# Altium project BW2098POE.PrjPcb (part 6 of 8)
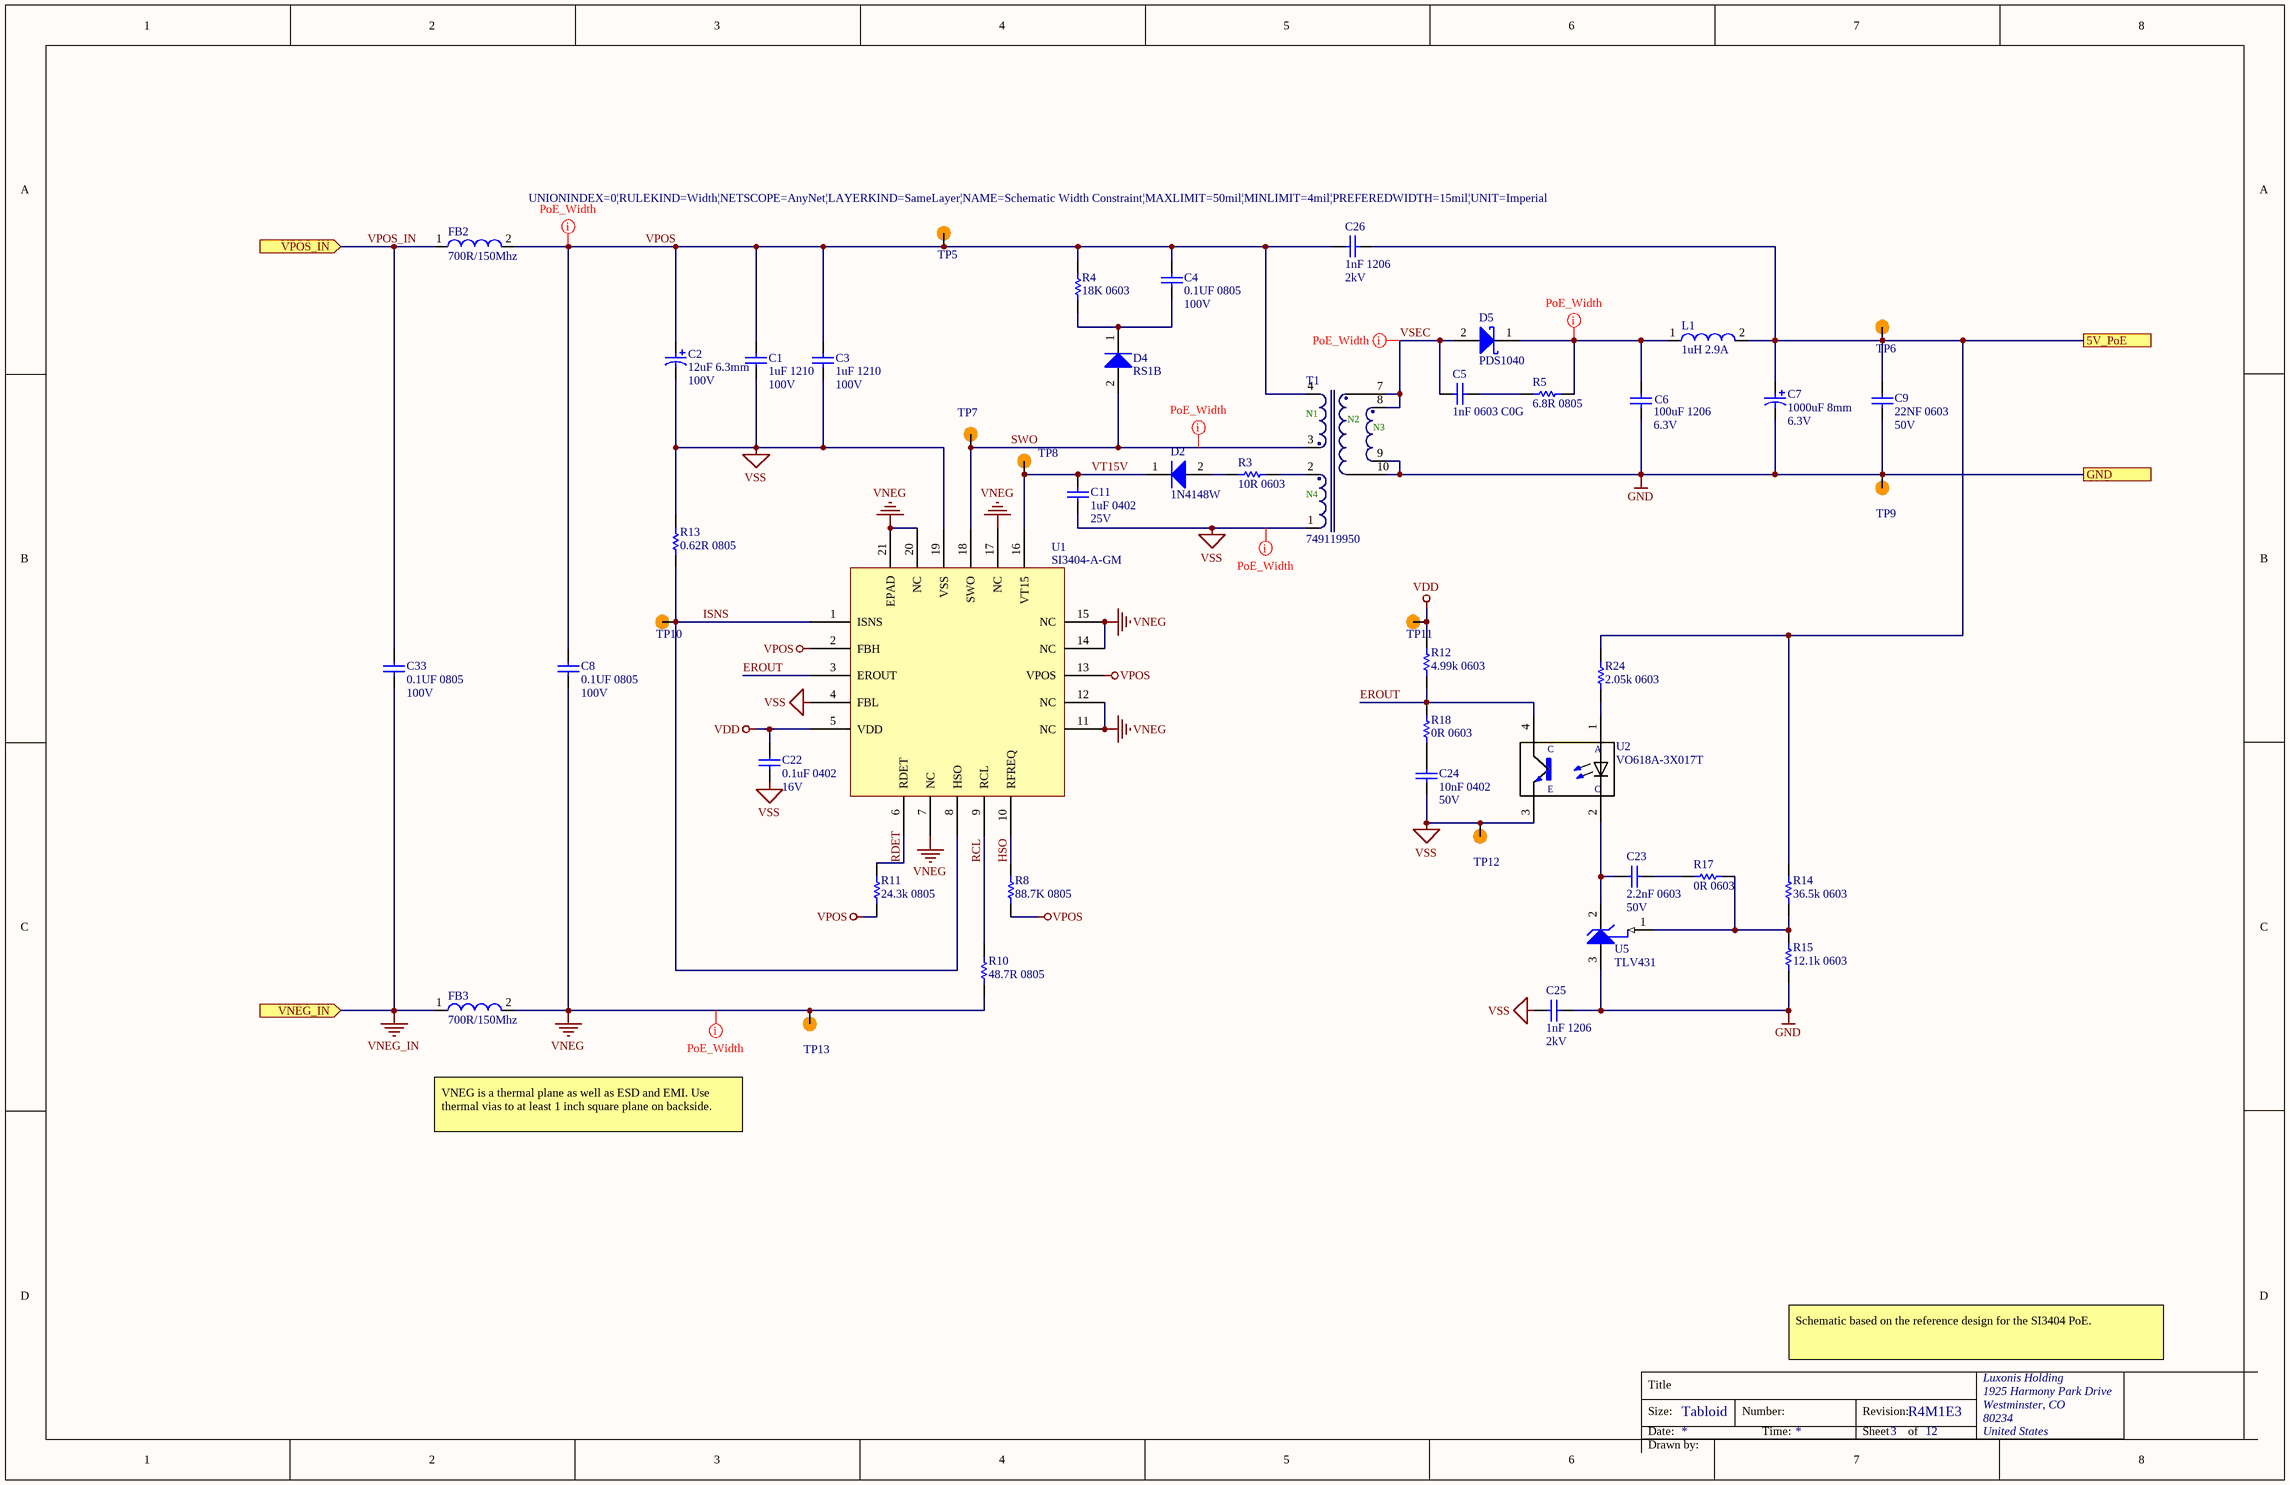
[diagram p13: PoE_Si3404.SchDoc]

## Sheet PoE_Si3404.SchDoc: =project_title (continued)
### Library data of the parts
C1 C3 = CL32B105KCJNNNE: CAP CER 1UF 100V X7R 1210; Manufacturer 1: Samsung; Tolerance: 10%; Supplier 1: Digi-Key; Manufacturer Part Number 1: CL32B105KCJNNNE; Stock 1: 69046; Pricing 1: 1=0.52000, 10=0.36100, 100=0.21650, 500=0.16236 (USD); RoHS: Yes; Mount: Surface Mount; Case/Package: 1210; Case Code (Metric): 3225; Case Code (Imperial): 1210; Min Operating Temperature: -55°C; Max Operating Temperature: 125°C; Packaging: Tape and Reel; Capacitance: 1uF; Dielectric: X7R; Voltage Rating (DC): 100V; Package Quantity: 1; Length: 3.2mm; Height: 2.5mm; Width: 0.098inch; Depth: 2.5mm; Thickness: 0.106inch; Radiation Hardening: No; Lead Free: Lead Free; ComponentLink1URL: https://datasheet.ciiva.com/26947/getdatasheetpartid-375850-26947031.pdf?src-supplier=Verical; ComponentLink1Description: https://datasheet.ciiva.com/26947/getdatasheetpartid-375850-26947031.pdf?src-supplier=Verical; ComponentLink2URL: https://datasheet.ciiva.com/16200/cl05b104kq5nnnc-16200037.pdf?src-supplier=Future+Electronics; ComponentLink2Description: https://datasheet.ciiva.com/16200/cl05b104kq5nnnc-16200037.pdf?src-supplier=Future+Electronics; Supplier 2: LCSC; Supplier 3: Future Electronics; Supplier Part Number 3: CL32B105KCJNNNE-CUTT; Supplier Part Number 2: C444847; Supplier Part Number 1: 1276-1812-1-ND
C2 = EEU-FC2A120: CAP ALUM 12UF 20% 100V RADIAL; Manufacturer 1: Panasonic; Lead/Base Style: Straight; Ripple Current: 114mA; Life (Hours): 1000Hour; ESR (Equivalent Series Resistance): 1.8R; Leakage Current: 3uA; Dissipation Factor: 0.07%; Polarity: Polar; Lead Diameter: 0.5mm; Supplier 1: Digi-Key; Manufacturer Part Number 1: EEU-FC2A120; Stock 1: 297; Pricing 1: 1=0.35000, 10=0.24500, 100=0.14670, 500=0.11002, 1000=0.09291, 2500=0.08802, 5000=0.08313 (USD); RoHS: Yes; Mount: Through Hole; Case/Package: Radial; Contact Plating: Tin; Min Operating Temperature: -55°C; Max Operating Temperature: 105°C; Capacitance: 12uF; Tolerance: 20%; Voltage Rating (DC): 100V; Packaging: Bulk; Package Quantity: 200; Voltage Rating: 100V; Impedance: 1.8R; Diameter: 6.3mm; Length: 11mm; Height: 11.2mm; Lead Pitch: 2.5mm; Height - Seated (Max): 0.48inch; Radiation Hardening: No; ComponentLink1URL: https://datasheet.ciiva.com/11781/0900766b80becf93-11781011.pdf?src-supplier=RSComponents; ComponentLink1Description: https://datasheet.ciiva.com/11781/0900766b80becf93-11781011.pdf?src-supplier=RSComponents; ComponentLink2URL: https://datasheet.ciiva.com/2984/aba0000ce22-2984054.pdf?src-supplier=Avnet; ComponentLink2Description: https://datasheet.ciiva.com/2984/aba0000ce22-2984054.pdf?src-supplier=Avnet; ComponentLink3URL: https://datasheet.ciiva.com/17535/aba0000ce22-17535638.pdf?src-supplier=Avnet+Europe; ComponentLink3Description: https://datasheet.ciiva.com/17535/aba0000ce22-17535638.pdf?src-supplier=Avnet+Europe; ComponentLink4URL: https://datasheet.ciiva.com/48518/eeufc-eng-tds-48518663.pdf?src-supplier=Distrelec; ComponentLink4Description: https://datasheet.ciiva.com/48518/eeufc-eng-tds-48518663.pdf?src-supplier=Distrelec; ComponentLink5URL: https://datasheet.ciiva.com/24023/a-e-461514-24023994.pdf?src-supplier=Mouser; ComponentLink5Description: https://datasheet.ciiva.com/24023/a-e-461514-24023994.pdf?src-supplier=Mouser; Supplier 2: Newark; Supplier Part Number 3: 667-EEU-FC2A120; Supplier Part Number 2: 47AC4895; Supplier 3: Mouser; Supplier Part Number 1: P19496-ND; Termination: Radial
C4 C8 C33 = CL21B104KCFNNNE: CAP CER 0.1UF 100V X7R 0805; Manufacturer 1: Samsung; Tolerance: 10%; Capacitance: 100nF; Supplier 1: Digi-Key; Manufacturer Part Number 1: CL21B104KCFNNNE; Stock 1: 93036; Pricing 1: 1=0.10000, 10=0.06800, 100=0.03050, 500=0.02180, 1000=0.01712 (USD); RoHS: Yes; Mount: Surface Mount; Case/Package: 0805; Case Code (Metric): 2012; Case Code (Imperial): 0805; Min Operating Temperature: -55°C; Max Operating Temperature: 125°C; Packaging: Tape and Reel; Dielectric: X7R; Length: 2mm; Width: 0.049inch; Thickness: 0.053inch; Depth: 1.25mm; Radiation Hardening: No; ComponentLink1URL: https://datasheet.ciiva.com/26936/getdatasheetpartid-781823-26936904.pdf?src-supplier=Verical; ComponentLink1Description: https://datasheet.ciiva.com/26936/getdatasheetpartid-781823-26936904.pdf?src-supplier=Verical; Supplier 2: Newark; Supplier 3: Future Electronics; Supplier Part Number 3: CL21B104KCFNNNE-CUTT; Supplier Part Number 2: 82AC9430; Supplier Part Number 1: 1276-6840-1-ND
C5 = GRM1885C1H102FA01D: CAP CER 1000PF 50V C0G/NP0 0603; Manufacturer: Murata; Material: Ceramic; Tolerance: 1%; Temperature Coefficient: 30ppm/°C; Manufacturer Part Number: GRM1885C1H102FA01D; RoHS: Yes; Mount: Surface Mount; Number of Pins: 2; Case Code (Metric): 1608; Case Code (Imperial): 0603; Min Operating Temperature: -55°C; Max Operating Temperature: 125°C; Packaging: Tape and Reel; Package Quantity: 4000; Termination: SMD/SMT; Voltage Rating (DC): 50V; Voltage: 50V; Length: 1.6mm; Height: 0.8mm; Width: 0.031inch; Thickness: 0.035inch; Depth: 0.8mm; Radiation Hardening: No; REACH SVHC: No SVHC; Lead Free: Lead Free; ComponentLink1URL: https://datasheet.ciiva.com/6072/1747444-6072454.pdf?src-supplier=Farnell; ComponentLink1Description: https://datasheet.ciiva.com/6072/1747444-6072454.pdf?src-supplier=Farnell; ComponentLink2URL: https://datasheet.ciiva.com/7828/1747444-7828892.pdf?src-supplier=Element14; ComponentLink2Description: https://datasheet.ciiva.com/7828/1747444-7828892.pdf?src-supplier=Element14; ComponentLink3URL: https://datasheet.ciiva.com/11621/c02e-11621692.pdf?src-supplier=Avnet; ComponentLink3Description: https://datasheet.ciiva.com/11621/c02e-11621692.pdf?src-supplier=Avnet; ComponentLink4URL: https://datasheet.ciiva.com/16624/c02e-16624140.pdf?src-supplier=Avnet+Europe; ComponentLink4Description: https://datasheet.ciiva.com/16624/c02e-16624140.pdf?src-supplier=Avnet+Europe; ComponentLink5URL: https://datasheet.ciiva.com/22698/1747444-22698428.pdf?src-supplier=Element14; ComponentLink5Description: https://datasheet.ciiva.com/22698/1747444-22698428.pdf?src-supplier=Element14; ComponentLink6URL: https://datasheet.ciiva.com/5416/c02e-5416637.pdf?src-supplier=Mouser; ComponentLink6Description: https://datasheet.ciiva.com/5416/c02e-5416637.pdf?src-supplier=Mouser; ComponentLink7URL: https://datasheet.ciiva.com/6270/partnumbering-e-01-6270573.pdf?src-supplier=Digi-Key; ComponentLink7Description: https://datasheet.ciiva.com/6270/partnumbering-e-01-6270573.pdf?src-supplier=Digi-Key; ComponentLink8URL: https://datasheet.ciiva.com/6270/partnumbering-e-01-6270574.pdf?src-supplier=Digi-Key; ComponentLink8Description: https://datasheet.ciiva.com/6270/partnumbering-e-01-6270574.pdf?src-supplier=Digi-Key; ComponentLink9URL: https://datasheet.ciiva.com/6270/partnumbering-e-01-6270575.pdf?src-supplier=Digi-Key; ComponentLink9Description: https://datasheet.ciiva.com/6270/partnumbering-e-01-6270575.pdf?src-supplier=Digi-Key; ComponentLink10URL: https://datasheet.ciiva.com/16426/l0005e-16426367.pdf?src-supplier=Future+Electronics; ComponentLink10Description: https://datasheet.ciiva.com/16426/l0005e-16426367.pdf?src-supplier=Future+Electronics; Supplier 1: Digi-Key; Manufacturer 1: Murata; Manufacturer Part Number 1: GRM1885C1H102FA01D; Stock 1: 343900; Pricing 1: 1=0.19000, 10=0.13300, 100=0.06260, 500=0.04386, 1000=0.03631 (USD); Case/Package: 0603; Capacitance: 1nF; Dielectric: C0G; Voltage Rating: 50V; Supplier Part Number 1: 490-6376-1-ND
C6 = CL31A107MQHNNNE: CAP CER 100UF 6.3V X5R 1206; Manufacturer 1: Samsung; Material: Ceramic; Tolerance: 20%; Supplier 1: Digi-Key; Manufacturer Part Number 1: CL31A107MQHNNNE; Stock 1: 75241; Pricing 1: 1=0.63000, 10=0.44200, 100=0.29120, 500=0.21574, 1000=0.18337 (USD); RoHS: Yes; Mount: Surface Mount; Case/Package: 1206; Case Code (Metric): 3216; Case Code (Imperial): 1206; Contact Plating: Tin; Min Operating Temperature: -55°C; Max Operating Temperature: 85°C; Capacitance: 100uF; Dielectric: X5R; Packaging: Tape and Reel; Package Quantity: 2000; Voltage Rating: 6.3V; Length: 3.2mm; Height: 1.6mm; Width: 0.063inch; Thickness: 0.071inch; Depth: 1.6mm; Radiation Hardening: No; ComponentLink1URL: https://datasheet.ciiva.com/25723/cl31a107mqhnnne-25723159.pdf?src-supplier=Digi-Key; ComponentLink1Description: https://datasheet.ciiva.com/25723/cl31a107mqhnnne-25723159.pdf?src-supplier=Digi-Key; ComponentLink2URL: https://datasheet.ciiva.com/16437/cl31a107mqhnnne-16437212.pdf?src-supplier=Future+Electronics; ComponentLink2Description: https://datasheet.ciiva.com/16437/cl31a107mqhnnne-16437212.pdf?src-supplier=Future+Electronics; ComponentLink3URL: https://datasheet.ciiva.com/15195/getdatasheetpartid-358449-15195997.pdf?src-supplier=Verical; ComponentLink3Description: https://datasheet.ciiva.com/15195/getdatasheetpartid-358449-15195997.pdf?src-supplier=Verical; ComponentLink4URL: https://datasheet.ciiva.com/29201/452463-da-01-en-vs-kondensator-1206-29201265.pdf?src-supplier=Conrad; ComponentLink4Description: https://datasheet.ciiva.com/29201/452463-da-01-en-vs-kondensator-1206-29201265.pdf?src-supplier=Conrad; ComponentLink5URL: https://datasheet.ciiva.com/20173/71-0886-20173093.pdf?src-supplier=Rapid+Electronics; ComponentLink5Description: https://datasheet.ciiva.com/20173/71-0886-20173093.pdf?src-supplier=Rapid+Electronics; Supplier 2: Newark; Supplier 3: Future Electronics; Supplier Part Number 1: 1276-1782-1-ND; Supplier Part Number 2: 82AC9489; Supplier Part Number 3: CL31A107MQHNNNE-CUTT
C7 = ECA-0JM102: CAP ALUM 1000UF 20% 6.3V RADIAL; Manufacturer 1: Panasonic; Capacitance: 1mF; Ripple Current: 580mA; Life (Hours): 2000Hour; Dissipation Factor: 0.28%; Lead/Base Style: Straight; Polarity: Polar; Leakage Current: 3uA; Lead Diameter: 0.6mm; Supplier 1: Digi-Key; Manufacturer Part Number 1: ECA-0JM102; Stock 1: 56407; Pricing 1: 1=0.31000, 10=0.21500, 100=0.12900, 500=0.09676, 1000=0.08170, 2500=0.07740, 5000=0.07310 (USD); RoHS: Yes; Mount: Through Hole,PCB; Case/Package: Radial; Number of Pins: 2; Contact Plating: Tin; Min Operating Temperature: -40°C; Max Operating Temperature: 85°C; Tolerance: 20%; Termination: Radial; Voltage Rating (DC): 6.3V; Packaging: Bulk; Voltage Rating: 6.3V; Package Quantity: 200; Diameter: 8mm; Length: 11.5mm; Height: 11.5mm; Lead Pitch: 3.5mm; Height - Seated (Max): 0.492inch; Radiation Hardening: No; REACH SVHC: No SVHC; ComponentLink1URL: https://datasheet.ciiva.com/11778/0900766b80f2e8a9-11778836.pdf?src-supplier=RSComponents; ComponentLink1Description: https://datasheet.ciiva.com/11778/0900766b80f2e8a9-11778836.pdf?src-supplier=RSComponents; ComponentLink2URL: https://datasheet.ciiva.com/16200/aba0000ce12-16200775.pdf?src-supplier=Future+Electronics; ComponentLink2Description: https://datasheet.ciiva.com/16200/aba0000ce12-16200775.pdf?src-supplier=Future+Electronics; ComponentLink3URL: https://datasheet.ciiva.com/17534/aba0000ce12-17534135.pdf?src-supplier=Avnet+Europe; ComponentLink3Description: https://datasheet.ciiva.com/17534/aba0000ce12-17534135.pdf?src-supplier=Avnet+Europe; ComponentLink4URL: https://datasheet.ciiva.com/24069/aba0000ce12-465472-24069879.pdf?src-supplier=Mouser; ComponentLink4Description: https://datasheet.ciiva.com/24069/aba0000ce12-465472-24069879.pdf?src-supplier=Mouser; ComponentLink5URL: https://datasheet.ciiva.com/46386/654936-46386263.pdf?src-supplier=Element14; ComponentLink5Description: https://datasheet.ciiva.com/46386/654936-46386263.pdf?src-supplier=Element14; ComponentLink6URL: https://datasheet.ciiva.com/2983/aba0000ce12-2983818.pdf?src-supplier=Avnet; ComponentLink6Description: https://datasheet.ciiva.com/2983/aba0000ce12-2983818.pdf?src-supplier=Avnet; ComponentLink7URL: https://datasheet.ciiva.com/16465/aba0000ce12-16465274.pdf?src-supplier=Avnet+Asia; ComponentLink7Description: https://datasheet.ciiva.com/16465/aba0000ce12-16465274.pdf?src-supplier=Avnet+Asia; ComponentLink8URL: https://datasheet.ciiva.com/15197/getdatasheetpartid-255691-15197835.pdf?src-supplier=Verical; ComponentLink8Description: https://datasheet.ciiva.com/15197/getdatasheetpartid-255691-15197835.pdf?src-supplier=Verical; ComponentLink9URL: https://datasheet.ciiva.com/92/aba0000ce12-92526.pdf?src-supplier=Digi-Key; ComponentLink9Description: https://datasheet.ciiva.com/92/aba0000ce12-92526.pdf?src-supplier=Digi-Key; ComponentLink10URL: https://datasheet.ciiva.com/30129/49aba0000ce12-30129310.pdf?src-supplier=Onlinecomponents.com; ComponentLink10Description: https://datasheet.ciiva.com/30129/49aba0000ce12-30129310.pdf?src-supplier=Onlinecomponents.com; Supplier 2: Newark; Supplier 3: Mouser; Supplier Part Number 3: 667-ECA-0JM102; Supplier Part Number 2: 17T4979; Supplier Part Number 1: P5115-ND
C9 = C0603C223K5RACTU: CAP CER 0.022UF 50V X7R 0603; Manufacturer 1: KEMET; Dielectric Material: Ceramic; Tolerance: 10%; Dissipation Factor: 2.5%; Supplier 1: Digi-Key; Manufacturer Part Number 1: C0603C223K5RACTU; Stock 1: 77845; Pricing 1: 1=0.10000, 10=0.06400, 100=0.02850, 500=0.02036, 1000=0.01600 (USD); RoHS: Yes; Mount: Surface Mount,PCB; Case/Package: 0603; Number of Pins: 2; Case Code (Imperial): 0603; Case Code (Metric): 1608; Contact Plating: Tin,Matte; Min Operating Temperature: -55°C; Max Operating Temperature: 125°C; Capacitance: 22nF; Packaging: Tape and Reel; Voltage Rating (DC): 50V; Dielectric: X7R; Package Quantity: 4000; Termination: SMD/SMT; Voltage Rating: 50V; Length: 1.6mm; Height: 0.8mm; Depth: 0.8mm; Width: 0.8mm; Thickness: 0.034inch; Lead Pitch: 0.7mm; Radiation Hardening: No; REACH SVHC: No SVHC; ComponentLink1URL: https://datasheet.ciiva.com/7823/1776091-7823698.pdf?src-supplier=Element14; ComponentLink1Description: https://datasheet.ciiva.com/7823/1776091-7823698.pdf?src-supplier=Element14; ComponentLink2URL: https://datasheet.ciiva.com/7824/kem-c1002-x7r-smd-7824021.pdf?src-supplier=Element14; ComponentLink2Description: https://datasheet.ciiva.com/7824/kem-c1002-x7r-smd-7824021.pdf?src-supplier=Element14; Supplier 2: Mouser; Supplier Part Number 1: 399-1280-6-ND; Supplier Part Number 2: 80-C0603C223K5R
C11 = GRM155R61E105KA12D: CAP CER 1UF 25V X5R 0402 10%; Manufacturer 1: Murata; Material: Ceramic; Supplier 1: Digi-Key; Manufacturer Part Number 1: GRM155R61E105KA12D; Stock 1: 200653; Pricing 1: 1=0.10000, 10=0.07100, 100=0.03350, 500=0.02352, 1000=0.01947, 2500=0.01812, 5000=0.01658 (USD); RoHS: Yes; Mount: Surface Mount; Case/Package: 0402; Weight: 0.000212oz; Case Code (Metric): 1005; Case Code (Imperial): 0402; Min Operating Temperature: -55°C; Max Operating Temperature: 85°C; Tolerance: 10%; Capacitance: 1uF; Dielectric: X5R; Voltage Rating (DC): 25V; Packaging: Tape and Reel; Package Quantity: 10000; Termination: SMD/SMT; Voltage: 25V; Length: 1mm; Height: 0.5mm; Width: 0.5mm; Thickness: 0.022inch; Depth: 0.5mm; Lead Free: Lead Free; REACH SVHC: No SVHC; ComponentLink1URL: https://datasheet.ciiva.com/22732/1666664-22732122.pdf?src-supplier=Element14; ComponentLink1Description: https://datasheet.ciiva.com/22732/1666664-22732122.pdf?src-supplier=Element14; ComponentLink2URL: https://datasheet.ciiva.com/7719/1666664-7719006.pdf?src-supplier=Element14; ComponentLink2Description: https://datasheet.ciiva.com/7719/1666664-7719006.pdf?src-supplier=Element14; Supplier Part Number 1: 490-10017-1-ND; Supplier 2: Arrow; Supplier 3: TTI; Supplier Part Number 2: GRM155R61E105KA12D; Supplier Part Number 3: GRM155R61E105KA12D
C22 = CL05B104KO5NFNC: CAP CER 0.1UF 16V X7R 0402; Manufacturer 1: Samsung; Tolerance: 10%; Capacitance: 100nF; Supplier 1: Digi-Key; Manufacturer Part Number 1: CL05B104KO5NFNC; Stock 1: 877172; Pricing 1: 1=0.10000, 10=0.02400, 100=0.01060, 500=0.00760, 1000=0.00597, 2500=0.00542, 5000=0.00499 (USD); RoHS: Yes; Mount: Surface Mount; Case/Package: 0402; Case Code (Metric): 1005; Case Code (Imperial): 0402; Min Operating Temperature: -55°C; Max Operating Temperature: 125°C; Packaging: Tape and Reel; Package Quantity: 1; Dielectric: X7R; Length: 1mm; Height: 0.5mm; Width: 0.02inch; Thickness: 0.022inch; Depth: 0.5mm; Radiation Hardening: No; ComponentLink1URL: https://datasheet.ciiva.com/25767/cl05b104ko5nfnc-25767124.pdf?src-supplier=Digi-Key; ComponentLink1Description: https://datasheet.ciiva.com/25767/cl05b104ko5nfnc-25767124.pdf?src-supplier=Digi-Key; Supplier 2: Newark; Supplier 3: Element14; Supplier Part Number 1: 1276-1508-1-ND; Supplier Part Number 3: 3013348; Supplier Part Number 2: 82AC9215
C23 = GRM1885C1H222JA01D: CAP CER 2200PF 50V C0G/NP0 0603; Manufacturer 1: Murata; Dielectric Material: Ceramic; Tolerance: 5%; Dielectric: C0G; Temperature Coefficient: 30ppm/°C; Insulation Resistance: 10GR; Supplier 1: Digi-Key; Manufacturer Part Number 1: GRM1885C1H222JA01D; Stock 1: 1457512; Pricing 1: 1=0.14000, 10=0.09800, 100=0.04610, 500=0.03234, 1000=0.02678 (USD); RoHS: Yes; Mount: Surface Mount; Case/Package: 0603; Number of Pins: 2; Case Code (Imperial): 0603; Case Code (Metric): 1608; Material: Ceramic; Min Operating Temperature: -55°C; Max Operating Temperature: 125°C; Capacitance: 2.2nF; Packaging: Tape and Reel; Voltage Rating (DC): 50V; Voltage Rating: 50V; Termination: SMD/SMT; Package Quantity: 1; Length: 1.6mm; Height: 0.8mm; Width: 0.8mm; Depth: 0.8mm; Thickness: 0.035inch; Radiation Hardening: No; Lead Free: Lead Free; REACH SVHC: No SVHC; ComponentLink1URL: https://datasheet.ciiva.com/11786/0900766b807a1cab-11786840.pdf?src-supplier=RSComponents; ComponentLink1Description: https://datasheet.ciiva.com/11786/0900766b807a1cab-11786840.pdf?src-supplier=RSComponents; ComponentLink2URL: https://datasheet.ciiva.com/3777/1632grm1885c1h222ja0123-3777835.pdf?src-supplier=Arrow; ComponentLink2Description: https://datasheet.ciiva.com/3777/1632grm1885c1h222ja0123-3777835.pdf?src-supplier=Arrow; ComponentLink3URL: https://datasheet.ciiva.com/2989/product-2989459.pdf?src-supplier=Avnet; ComponentLink3Description: https://datasheet.ciiva.com/2989/product-2989459.pdf?src-supplier=Avnet; ComponentLink4URL: https://datasheet.ciiva.com/6031/4360-6031797.pdf?src-supplier=Farnell; ComponentLink4Description: https://datasheet.ciiva.com/6031/4360-6031797.pdf?src-supplier=Farnell; ComponentLink5URL: https://datasheet.ciiva.com/7828/4360-7828918.pdf?src-supplier=Element14; ComponentLink5Description: https://datasheet.ciiva.com/7828/4360-7828918.pdf?src-supplier=Element14; ComponentLink6URL: https://datasheet.ciiva.com/11463/product-11463974.pdf?src-supplier=Avnet; ComponentLink6Description: https://datasheet.ciiva.com/11463/product-11463974.pdf?src-supplier=Avnet; ComponentLink7URL: https://datasheet.ciiva.com/16624/product-16624150.pdf?src-supplier=Avnet+Europe; ComponentLink7Description: https://datasheet.ciiva.com/16624/product-16624150.pdf?src-supplier=Avnet+Europe; ComponentLink8URL: https://datasheet.ciiva.com/7828/1747455-7828919.pdf?src-supplier=Element14; ComponentLink8Description: https://datasheet.ciiva.com/7828/1747455-7828919.pdf?src-supplier=Element14; ComponentLink9URL: https://datasheet.ciiva.com/133/partnumbering-e-01-133576.pdf?src-supplier=Digi-Key; ComponentLink9Description: https://datasheet.ciiva.com/133/partnumbering-e-01-133576.pdf?src-supplier=Digi-Key; ComponentLink10URL: https://datasheet.ciiva.com/7828/1747455-7828920.pdf?src-supplier=Element14; ComponentLink10Description: https://datasheet.ciiva.com/7828/1747455-7828920.pdf?src-supplier=Element14; ComponentLink11URL: https://datasheet.ciiva.com/133/partnumbering-e-01-133577.pdf?src-supplier=Digi-Key; ComponentLink11Description: https://datasheet.ciiva.com/133/partnumbering-e-01-133577.pdf?src-supplier=Digi-Key; ComponentLink12URL: https://datasheet.ciiva.com/133/partnumbering-e-01-133578.pdf?src-supplier=Digi-Key; ComponentLink12Description: https://datasheet.ciiva.com/133/partnumbering-e-01-133578.pdf?src-supplier=Digi-Key; ComponentLink13URL: https://datasheet.ciiva.com/29241/450664-da-01-en-vs-kondensator-0603-29241770.pdf?src-supplier=Conrad; ComponentLink13Description: https://datasheet.ciiva.com/29241/450664-da-01-en-vs-kondensator-0603-29241770.pdf?src-supplier=Conrad; Supplier 2: Future Electronics; Supplier 3: Mouser; Supplier Part Number 1: 490-1459-1-ND; Supplier Part Number 2: GRM1885C1H222JA01D-CUTT; Supplier Part Number 3: 81-GRM1885C1H222JA01
C24 = GRM155R71H103KA88D: CAP CER 10000PF 50V X7R 0402; Manufacturer 1: Murata; Material: Ceramic; Tolerance: 10%; Voltage: 25V; Supplier 1: Digi-Key; Manufacturer Part Number 1: GRM155R71H103KA88D; Stock 1: 6923572; Pricing 1: 1=0.10000, 10=0.03800, 100=0.01690, 500=0.01208, 1000=0.00949, 2500=0.00862, 5000=0.00794 (USD); RoHS: Yes; Mount: Surface Mount; Case/Package: 0402; Number of Pins: 2; Case Code (Metric): 1005; Case Code (Imperial): 0402; Min Operating Temperature: -55°C; Max Operating Temperature: 125°C; Capacitance: 10nF; Packaging: Tape and Reel; Termination: SMD/SMT; Voltage Rating (DC): 50V; Package Quantity: 1; Dielectric: X7R; Length: 1mm; Height: 0.5mm; Width: 0.02inch; Thickness: 0.022inch; Depth: 0.5mm; Radiation Hardening: No; REACH SVHC: No SVHC; Lead Free: Lead Free; ComponentLink1URL: https://datasheet.ciiva.com/129/product-129810.pdf?src-supplier=Digi-Key; ComponentLink1Description: https://datasheet.ciiva.com/129/product-129810.pdf?src-supplier=Digi-Key; ComponentLink2URL: https://datasheet.ciiva.com/19476/1856433-19476546.pdf?src-supplier=Jameco; ComponentLink2Description: https://datasheet.ciiva.com/19476/1856433-19476546.pdf?src-supplier=Jameco; ComponentLink3URL: https://datasheet.ciiva.com/11786/0900766b80ef921d-11786340.pdf?src-supplier=RSComponents; ComponentLink3Description: https://datasheet.ciiva.com/11786/0900766b80ef921d-11786340.pdf?src-supplier=RSComponents; ComponentLink4URL: https://datasheet.ciiva.com/18100/getdatasheetpartid-27434-18100660.pdf?src-supplier=Verical; ComponentLink4Description: https://datasheet.ciiva.com/18100/getdatasheetpartid-27434-18100660.pdf?src-supplier=Verical; ComponentLink5URL: https://datasheet.ciiva.com/22698/1747449-22698420.pdf?src-supplier=Element14; ComponentLink5Description: https://datasheet.ciiva.com/22698/1747449-22698420.pdf?src-supplier=Element14; ComponentLink6URL: https://datasheet.ciiva.com/29199/454225-da-01-en-vs-kondensator-0402-29199740.pdf?src-supplier=Conrad; ComponentLink6Description: https://datasheet.ciiva.com/29199/454225-da-01-en-vs-kondensator-0402-29199740.pdf?src-supplier=Conrad; ComponentLink7URL: https://datasheet.ciiva.com/129/grm155r71h103ka88-01-129811.pdf?src-supplier=Digi-Key; ComponentLink7Description: https://datasheet.ciiva.com/129/grm155r71h103ka88-01-129811.pdf?src-supplier=Digi-Key; ComponentLink8URL: https://datasheet.ciiva.com/129/grm155r71h103ka88-01-129812.pdf?src-supplier=Digi-Key; ComponentLink8Description: https://datasheet.ciiva.com/129/grm155r71h103ka88-01-129812.pdf?src-supplier=Digi-Key; ComponentLink9URL: https://datasheet.ciiva.com/16495/product-16495290.pdf?src-supplier=Future+Electronics; ComponentLink9Description: https://datasheet.ciiva.com/16495/product-16495290.pdf?src-supplier=Future+Electronics; ComponentLink10URL: https://datasheet.ciiva.com/5410/product-5410990.pdf?src-supplier=Mouser; ComponentLink10Description: https://datasheet.ciiva.com/5410/product-5410990.pdf?src-supplier=Mouser; Supplier 2: Mouser; Supplier 3: Arrow; Supplier Part Number 1: 490-4516-1-ND; Supplier Part Number 2: 81-GRM155R71H103KA8D; Supplier Part Number 3: GRM155R71H103KA88D
C25 C26 = C1206C102KGRACTU: CAP CER 1000PF 2KV X7R 1206; Manufacturer 1: KEMET; Dielectric Material: Ceramic; Tolerance: 10%; Supplier 1: Digi-Key; Manufacturer Part Number 1: C1206C102KGRACTU; Stock 1: 54320; Pricing 1: 1=0.26000, 10=0.17500, 100=0.09940, 500=0.07014, 1000=0.06138 (USD); RoHS: Yes; Mount: Surface Mount; Case/Package: 1206; Min Operating Temperature: -55°C; Max Operating Temperature: 125°C; Capacitance: 1nF; Packaging: Tape and Reel; Dielectric: X7R; Length: 3.2mm; Height: 1.6mm; Depth: 1.6mm; Radiation Hardening: No; ComponentLink1URL: https://datasheet.ciiva.com/18194/getdatasheetpartid-359031-18194095.pdf?src-supplier=Verical; ComponentLink1Description: https://datasheet.ciiva.com/18194/getdatasheetpartid-359031-18194095.pdf?src-supplier=Verical; ComponentLink2URL: https://datasheet.ciiva.com/28610/1372242-28610895.pdf?src-supplier=Element14; ComponentLink2Description: https://datasheet.ciiva.com/28610/1372242-28610895.pdf?src-supplier=Element14; ComponentLink3URL: https://datasheet.ciiva.com/28672/1807957-28672854.pdf?src-supplier=Element14; ComponentLink3Description: https://datasheet.ciiva.com/28672/1807957-28672854.pdf?src-supplier=Element14; Supplier 2: Newark; Supplier 3: Newark; Supplier Part Number 1: 399-4819-1-ND; Supplier Part Number 2: 01N5611; Supplier Part Number 3: 68K2517
D2 = 1N4148W-7-F: DIODE GEN PURP 100V 300MA SOD123; Manufacturer 1: Diodes; Element Configuration: Single; Forward Current: 150mA; Forward Voltage: 1.25V; Reverse Recovery Time: 4ns; Peak Non-Repetitive Surge Current: 2A; Peak Reverse Current: 1uA; Power Dissipation: 400mW; Polarity: Standard; Voltage Rating (DC): 75V; Capacitance: 2pF; Current: 15A; Supplier 1: Digi-Key; Manufacturer Part Number 1: 1N4148W-7-F; Stock 1: 5430248; Pricing 1: 1=0.16000, 10=0.15000, 100=0.06290, 500=0.04942, 1000=0.03432 (USD); RoHS: Yes; Mount: Surface Mount; Number of Pins: 2; Weight: 0.000353oz; Contact Plating: Tin,Matte; Min Operating Temperature: -65°C; Max Operating Temperature: 150°C; Packaging: Tape and Reel; Package Quantity: 3000; Max Repetitive Reverse Voltage (Vrrm): 100V; Recovery Time: 4ns; Average Rectified Current: 300mA; Max Reverse Voltage (DC): 100V; Max Surge Current: 2A; Max Forward Surge Current (Ifsm): 2A; Power Rating: 400mW; Current Rating: 150mA; Output Current: 150mA; Voltage: 100V; Length: 2.85mm; Height: 1.25mm; Width: 1.7mm; Radiation Hardening: No; Lead Free: Lead Free; REACH SVHC: No SVHC; ComponentLink1URL: https://datasheet.ciiva.com/4435/ds30086-4435128.pdf?src-supplier=Mouser; ComponentLink1Description: https://datasheet.ciiva.com/4435/ds30086-4435128.pdf?src-supplier=Mouser; ComponentLink2URL: https://datasheet.ciiva.com/8300/ds30086-8300392.pdf?src-supplier=Avnet; ComponentLink2Description: https://datasheet.ciiva.com/8300/ds30086-8300392.pdf?src-supplier=Avnet; ComponentLink3URL: https://datasheet.ciiva.com/911/ds30086-911734.pdf?src-supplier=Digi-Key; ComponentLink3Description: https://datasheet.ciiva.com/911/ds30086-911734.pdf?src-supplier=Digi-Key; ComponentLink4URL: https://datasheet.ciiva.com/911/ds30086-911735.pdf?src-supplier=Digi-Key; ComponentLink4Description: https://datasheet.ciiva.com/911/ds30086-911735.pdf?src-supplier=Digi-Key; ComponentLink5URL: https://datasheet.ciiva.com/22695/1915529-22695239.pdf?src-supplier=Element14; ComponentLink5Description: https://datasheet.ciiva.com/22695/1915529-22695239.pdf?src-supplier=Element14; ComponentLink6URL: https://datasheet.ciiva.com/911/ds30086-911736.pdf?src-supplier=Digi-Key; ComponentLink6Description: https://datasheet.ciiva.com/911/ds30086-911736.pdf?src-supplier=Digi-Key; ComponentLink7URL: https://datasheet.ciiva.com/1179/1915529-1179304.pdf?src-supplier=Element14; ComponentLink7Description: https://datasheet.ciiva.com/1179/1915529-1179304.pdf?src-supplier=Element14; ComponentLink8URL: https://datasheet.ciiva.com/25919/ds30086-25919609.pdf?src-supplier=Avnet+Europe; ComponentLink8Description: https://datasheet.ciiva.com/25919/ds30086-25919609.pdf?src-supplier=Avnet+Europe; ComponentLink9URL: https://datasheet.ciiva.com/15219/getdatasheetpartid-110030-15219548.pdf?src-supplier=Verical; ComponentLink9Description: https://datasheet.ciiva.com/15219/getdatasheetpartid-110030-15219548.pdf?src-supplier=Verical; ComponentLink10URL: https://datasheet.ciiva.com/8303/ds30086-8303197.pdf?src-supplier=Avnet; ComponentLink10Description: https://datasheet.ciiva.com/8303/ds30086-8303197.pdf?src-supplier=Avnet; Supplier 2: Newark; Supplier 3: Mouser; Supplier Part Number 1: 1N4148W-FDICT-ND; Supplier Part Number 2: 52R3924; Supplier Part Number 3: 621-1N4148W-F
D4 = RS1B: DIODE GEN PURP 100V 1A SMA; Manufacturer 1: ON Semiconductor / Fairchild; Reverse Recovery Time: 150ns; Element Configuration: Single; Peak Reverse Current: 5uA; Peak Non-Repetitive Surge Current: 30A; Forward Voltage: 1.3V; Polarity: Standard; Capacitance: 10pF; Power Dissipation: 1.19W; Supplier 1: Digi-Key; Manufacturer Part Number 1: RS1B; Stock 1: 3961; Pricing 1: 1=0.43000, 10=0.32100, 100=0.15260, 500=0.12452, 1000=0.09239 (USD); RoHS: Yes; Mount: Surface Mount; Case/Package: SMA; Number of Pins: 2; Weight: 0.106g; Min Operating Temperature: -55°C; Max Operating Temperature: 150°C; Packaging: Tape and Reel; Forward Current: 1A; Max Repetitive Reverse Voltage (Vrrm): 100V; Max Reverse Voltage (DC): 100V; Average Rectified Current: 1A; Package Quantity: 1; Max Surge Current: 30A; Recovery Time: 150ns; Voltage Rating (DC): 100V; Current Rating: 1A; Output Current: 1A; Max Forward Surge Current (Ifsm): 30A; Reverse Voltage: 100V; Length: 4.75mm; Height: 2.2mm; Width: 2.95mm; Radiation Hardening: No; Lead Free: Lead Free; ComponentLink1URL: https://datasheet.ciiva.com/4452/rs1b-191999-4452400.pdf?src-supplier=Mouser; ComponentLink1Description: https://datasheet.ciiva.com/4452/rs1b-191999-4452400.pdf?src-supplier=Mouser; ComponentLink2URL: https://datasheet.ciiva.com/17433/rs1b-17433986.pdf?src-supplier=Future+Electronics; ComponentLink2Description: https://datasheet.ciiva.com/17433/rs1b-17433986.pdf?src-supplier=Future+Electronics; ComponentLink3URL: https://datasheet.ciiva.com/26232/rs1m-26232022.pdf?src-supplier=Avnet+Europe; ComponentLink3Description: https://datasheet.ciiva.com/26232/rs1m-26232022.pdf?src-supplier=Avnet+Europe; ComponentLink4URL: https://datasheet.ciiva.com/6381/rs1a-6381114.pdf?src-supplier=Digi-Key; ComponentLink4Description: https://datasheet.ciiva.com/6381/rs1a-6381114.pdf?src-supplier=Digi-Key; ComponentLink5URL: https://datasheet.ciiva.com/8300/rs1m-8300922.pdf?src-supplier=Avnet; ComponentLink5Description: https://datasheet.ciiva.com/8300/rs1m-8300922.pdf?src-supplier=Avnet; ComponentLink6URL: https://datasheet.ciiva.com/6381/rs1a-6381113.pdf?src-supplier=Digi-Key; ComponentLink6Description: https://datasheet.ciiva.com/6381/rs1a-6381113.pdf?src-supplier=Digi-Key; ComponentLink7URL: https://datasheet.ciiva.com/6381/rs1a-6381115.pdf?src-supplier=Digi-Key; ComponentLink7Description: https://datasheet.ciiva.com/6381/rs1a-6381115.pdf?src-supplier=Digi-Key; ComponentLink8URL: https://datasheet.ciiva.com/26818/getdatasheetpartid-71159-26818043.pdf?src-supplier=Verical; ComponentLink8Description: https://datasheet.ciiva.com/26818/getdatasheetpartid-71159-26818043.pdf?src-supplier=Verical; Supplier 2: Newark; Supplier 3: Mouser; Supplier Part Number 1: RS1BFSCT-ND; Supplier Part Number 2: 29AC9918; Supplier Part Number 3: 512-RS1B
D5 = PDS1040-13: DIODE SCHOTTKY 40V 10A POWERDI5; Manufacturer 1: Diodes; Element Configuration: Common Anode; Peak Reverse Current: 700uA; Peak Non-Repetitive Surge Current: 275A; Forward Voltage: 510mV; Polarity: Standard; Supplier 1: Digi-Key; Manufacturer Part Number 1: PDS1040-13; Stock 1: 45541; Pricing 1: 1=1.20000, 10=1.07400, 100=0.76440, 500=0.64792, 1000=0.52780 (USD); RoHS: Yes; Mount: Surface Mount; Number of Pins: 5; Weight: 0.003386oz; Contact Plating: Tin,Matte; Min Operating Temperature: -65°C; Max Operating Temperature: 180°C; Forward Current: 10A; Max Repetitive Reverse Voltage (Vrrm): 40V; Packaging: Tape and Reel; Package Quantity: 5000; Average Rectified Current: 10A; Max Forward Surge Current (Ifsm): 275A; Termination: SMD/SMT; Voltage Rating (DC): 40V; Current Rating: 10A; Output Current: 10A; Max Reverse Voltage (DC): 40V; Length: 4.05mm; Height: 1.15mm; Width: 5.45mm; Radiation Hardening: No; REACH SVHC: No SVHC; Lead Free: Lead Free; ComponentLink1URL: https://datasheet.ciiva.com/8300/ds30538-8300993.pdf?src-supplier=Avnet; ComponentLink1Description: https://datasheet.ciiva.com/8300/ds30538-8300993.pdf?src-supplier=Avnet; ComponentLink2URL: https://datasheet.ciiva.com/4715/ds30538-79818-4715685.pdf?src-supplier=Mouser; ComponentLink2Description: https://datasheet.ciiva.com/4715/ds30538-79818-4715685.pdf?src-supplier=Mouser; ComponentLink3URL: https://datasheet.ciiva.com/25947/ds30538-25947424.pdf?src-supplier=Avnet+Europe; ComponentLink3Description: https://datasheet.ciiva.com/25947/ds30538-25947424.pdf?src-supplier=Avnet+Europe; ComponentLink4URL: https://datasheet.ciiva.com/34302/1541335-34302410.pdf?src-supplier=Jameco; ComponentLink4Description: https://datasheet.ciiva.com/34302/1541335-34302410.pdf?src-supplier=Jameco; ComponentLink5URL: https://datasheet.ciiva.com/915/ds30538-915075.pdf?src-supplier=Digi-Key; ComponentLink5Description: https://datasheet.ciiva.com/915/ds30538-915075.pdf?src-supplier=Digi-Key; ComponentLink6URL: https://datasheet.ciiva.com/915/ds30538-915076.pdf?src-supplier=Digi-Key; ComponentLink6Description: https://datasheet.ciiva.com/915/ds30538-915076.pdf?src-supplier=Digi-Key; ComponentLink7URL: https://datasheet.ciiva.com/16215/ds30538-16215597.pdf?src-supplier=Future+Electronics; ComponentLink7Description: https://datasheet.ciiva.com/16215/ds30538-16215597.pdf?src-supplier=Future+Electronics; ComponentLink8URL: https://datasheet.ciiva.com/915/ds30538-915074.pdf?src-supplier=Digi-Key; ComponentLink8Description: https://datasheet.ciiva.com/915/ds30538-915074.pdf?src-supplier=Digi-Key; ComponentLink9URL: https://datasheet.ciiva.com/7964/ds30538-7964283.pdf?src-supplier=Element14; ComponentLink9Description: https://datasheet.ciiva.com/7964/ds30538-7964283.pdf?src-supplier=Element14; Supplier 2: Newark; Supplier 3: Mouser; Supplier Part Number 1: PDS1040DICT-ND; Supplier Part Number 2: 25R4894; Supplier Part Number 3: 621-PDS1040-13
FB2 FB3 = 742792040: FERRITE BEAD 600 OHM 0805 1LN; Manufacturer 1: Wurth Electronics; Current Rating: 2A; Inductance: 5.6H; Tolerance: 25%; Impedance: 600R; Number of Lines: 1; DC Resistance (DCR): 150mR; Test Frequency: 100MHz; Supplier 1: Allied Electronics; Manufacturer Part Number 1: 742792040; Stock 1: 50; Pricing 1: 1=0.10100, 50=0.09600, 100=0.08600, 250=0.08100, 500=0.07600 (USD); RoHS: Yes; Mount: Surface Mount; Case/Package: SMD/SMT; Weight: 0.000388oz; Core Material: Ferrite; Case Code (Metric): 2012; Case Code (Imperial): 0805; Material: Ferrite; Min Operating Temperature: -55°C; Max Operating Temperature: 125°C; Package Quantity: 1; Packaging: Tape and Reel; Max Current Rating: 2A; Max DC Current: 2A; Termination: SMD/SMT; Length: 2mm; Height: 0.9mm; Width: 0.047inch; Depth: 1.2mm; REACH SVHC: Unknown; Lead Free: Lead Free; ComponentLink1URL: https://datasheet.ciiva.com/4940/742792040-80980-4940454.pdf?src-supplier=Mouser; ComponentLink1Description: https://datasheet.ciiva.com/4940/742792040-80980-4940454.pdf?src-supplier=Mouser; ComponentLink2URL: https://datasheet.ciiva.com/1560/742792040-1560864.pdf?src-supplier=Newark; ComponentLink2Description: https://datasheet.ciiva.com/1560/742792040-1560864.pdf?src-supplier=Newark; ComponentLink3URL: https://datasheet.ciiva.com/1013/742792040-1013539.pdf?src-supplier=Digi-Key; ComponentLink3Description: https://datasheet.ciiva.com/1013/742792040-1013539.pdf?src-supplier=Digi-Key; ComponentLink4URL: https://datasheet.ciiva.com/11799/0900766b80d2dd7f-11799667.pdf?src-supplier=RSComponents; ComponentLink4Description: https://datasheet.ciiva.com/11799/0900766b80d2dd7f-11799667.pdf?src-supplier=RSComponents; ComponentLink5URL: https://datasheet.ciiva.com/22711/1756153-22711349.pdf?src-supplier=Element14; ComponentLink5Description: https://datasheet.ciiva.com/22711/1756153-22711349.pdf?src-supplier=Element14; ComponentLink6URL: https://datasheet.ciiva.com/1013/742792040-1013541.pdf?src-supplier=Digi-Key; ComponentLink6Description: https://datasheet.ciiva.com/1013/742792040-1013541.pdf?src-supplier=Digi-Key; ComponentLink7URL: https://datasheet.ciiva.com/1013/742792040-1013540.pdf?src-supplier=Digi-Key; ComponentLink7Description: https://datasheet.ciiva.com/1013/742792040-1013540.pdf?src-supplier=Digi-Key; ComponentLink8URL: https://datasheet.ciiva.com/1126/1756153-1126571.pdf?src-supplier=Element14; ComponentLink8Description: https://datasheet.ciiva.com/1126/1756153-1126571.pdf?src-supplier=Element14; Supplier 2: Mouser; Supplier 3: Newark; Supplier Part Number 1: 70996355; Supplier Part Number 2: 710-742792040; Supplier Part Number 3: 08P2371
L1 = DO1608C-102ML: IND POWER WIREWOUND 1uH 20% 100KHz FERRITE 2.7A; Manufacturer 1: Coilcraft; Manufacturer Part Number 1: DO1608C-102MLC; Self Resonant Frequency: 130MHz; DC Resistance (DCR): 50mR; Supplier 1: Coilcraft Direct; Stock 1: 27185; Pricing 1: 1=0.88000, 750=0.64000, 1500=0.49000, 3000=0.38000, 6000=0.31000 (USD); RoHS: Yes; Mount: Surface Mount; Case/Package: SMD/SMT; Core Material: Ferrite; Min Operating Temperature: -40°C; Max Operating Temperature: 85°C; Packaging: Tape and Reel; Inductance: 1uH; Tolerance: 20%; Max DC Current: 2.7A; Termination: SMD/SMT; Test Frequency: 100kHz; Inductance Tolerance: 20%; RMS Current (Irms): 2.7A; Saturation Current: 2.9A; Length: 6.6mm; Height: 2.92mm; Width: 4.45mm; Lead Free: Contains Lead; REACH SVHC: No SVHC; ComponentLink1URL: https://datasheet.ciiva.com/22698/1681900-22698293.pdf?src-supplier=Element14; ComponentLink1Description: https://datasheet.ciiva.com/22698/1681900-22698293.pdf?src-supplier=Element14; ComponentLink2URL: https://datasheet.ciiva.com/22623/1681900-22623607.pdf?src-supplier=Element14; ComponentLink2Description: https://datasheet.ciiva.com/22623/1681900-22623607.pdf?src-supplier=Element14; ComponentLink3URL: https://datasheet.ciiva.com/13142/do1608c-13142540.pdf?src-supplier=Mouser; ComponentLink3Description: https://datasheet.ciiva.com/13142/do1608c-13142540.pdf?src-supplier=Mouser; Supplier 2: Mouser; Supplier Part Number 1: DO1608C-102MLC; Supplier Part Number 2: 994-DO1608C-102MLC
R3 = CRCW060310R0FKEA: RES SMD 10 OHM 1% 1/10W 0603; Manufacturer 1: Vishay; Power Rating: 100mW; Temperature Coefficient: 100ppm/°C; Voltage Rating: 75V; Supplier 1: Digi-Key; Manufacturer Part Number 1: CRCW060310R0FKEA; Stock 1: 155545; Pricing 1: 1=0.10000, 10=0.03400, 100=0.01390, 1000=0.00623, 2500=0.00540 (USD); RoHS: Yes; Mount: Surface Mount; Case/Package: 0603; Number of Pins: 2; Weight: 7.1E-05oz; Contact Plating: Tin; Case Code (Metric): 1608; Case Code (Imperial): 0603; Min Operating Temperature: -55°C; Max Operating Temperature: 155°C; Resistance: 10R; Tolerance: 1%; Composition: Thick Film; Packaging: Tape and Reel; Package Quantity: 10; Number of Terminations: 2; Termination: SMD/SMT; Military Standard: Not; Max Power Dissipation: 100mW; Voltage Rating (DC): 75V; Features: Automotive AEC-Q200; Length: 1.55mm; Height: 0.45mm; Width: 0.033inch; Depth: 0.85mm; Lead Free: Lead Free; REACH SVHC: Unknown; ComponentLink1URL: https://datasheet.ciiva.com/11808/0900766b80d98afc-11808660.pdf?src-supplier=RSComponents; ComponentLink1Description: https://datasheet.ciiva.com/11808/0900766b80d98afc-11808660.pdf?src-supplier=RSComponents; ComponentLink2URL: https://datasheet.ciiva.com/3256/dcrcwe3-3256955.pdf?src-supplier=Avnet; ComponentLink2Description: https://datasheet.ciiva.com/3256/dcrcwe3-3256955.pdf?src-supplier=Avnet; ComponentLink3URL: https://datasheet.ciiva.com/5547/dcrcwe3-109170-5547342.pdf?src-supplier=Mouser; ComponentLink3Description: https://datasheet.ciiva.com/5547/dcrcwe3-109170-5547342.pdf?src-supplier=Mouser; ComponentLink4URL: https://datasheet.ciiva.com/22673/1697337-22673071.pdf?src-supplier=Element14; ComponentLink4Description: https://datasheet.ciiva.com/22673/1697337-22673071.pdf?src-supplier=Element14; ComponentLink5URL: https://datasheet.ciiva.com/2465/dcrcwe3-2465699.pdf?src-supplier=Digi-Key; ComponentLink5Description: https://datasheet.ciiva.com/2465/dcrcwe3-2465699.pdf?src-supplier=Digi-Key; ComponentLink6URL: https://datasheet.ciiva.com/2465/dcrcwe3-2465701.pdf?src-supplier=Digi-Key; ComponentLink6Description: https://datasheet.ciiva.com/2465/dcrcwe3-2465701.pdf?src-supplier=Digi-Key; ComponentLink7URL: https://datasheet.ciiva.com/26316/fld-crcw-e3-data-en-26316582.pdf?src-supplier=Distrelec; ComponentLink7Description: https://datasheet.ciiva.com/26316/fld-crcw-e3-data-en-26316582.pdf?src-supplier=Distrelec; ComponentLink8URL: https://datasheet.ciiva.com/16781/70201119-16781847.pdf?src-supplier=Allied+Electronics; ComponentLink8Description: https://datasheet.ciiva.com/16781/70201119-16781847.pdf?src-supplier=Allied+Electronics; ComponentLink9URL: https://datasheet.ciiva.com/2465/dcrcwe3-2465700.pdf?src-supplier=Digi-Key; ComponentLink9Description: https://datasheet.ciiva.com/2465/dcrcwe3-2465700.pdf?src-supplier=Digi-Key; ComponentLink10URL: https://datasheet.ciiva.com/16740/dcrcwe3-16740661.pdf?src-supplier=Future+Electronics; ComponentLink10Description: https://datasheet.ciiva.com/16740/dcrcwe3-16740661.pdf?src-supplier=Future+Electronics; Supplier 2: Mouser; Supplier 3: Newark; Supplier Part Number 1: 541-10.0HDKR-ND; Supplier Part Number 2: 71-CRCW0603-10-E3; Supplier Part Number 3: 61M5338
R4 = RC0603JR-0718KL: RES SMD 18K OHM 5% 1/10W 0603; Manufacturer 1: Yageo; Resistance: 18kR; Power Rating: 100mW; Temperature Coefficient: 100ppm/°C; Voltage Rating: 75V; Voltage Rating (DC): 50V; Supplier 1: Digi-Key; Manufacturer Part Number 1: RC0603JR-0718KL; Stock 1: 660239; Pricing 1: 1=0.10000, 10=0.01900, 100=0.00770, 1000=0.00347, 2500=0.00301 (USD); RoHS: Yes; Case/Package: 0603; Number of Pins: 2; Weight: 7.1E-05oz; Case Code (Metric): 1608; Case Code (Imperial): 0603; Min Operating Temperature: -55°C; Max Operating Temperature: 155°C; Tolerance: 5%; Packaging: Tape and Reel; Composition: Thick Film; Package Quantity: 1; Number of Terminations: 2; Termination: SMD/SMT; Max Power Dissipation: 100mW; Military Standard: Not; Features: Moisture Resistant; Length: 1.6mm; Height: 0.022inch; Width: 0.8mm; Depth: 0.8mm; Lead Free: Lead Free; REACH SVHC: No SVHC; ComponentLink1URL: https://datasheet.ciiva.com/2452/pyu-r-int-thick-7-2452965.pdf?src-supplier=Digi-Key; ComponentLink1Description: https://datasheet.ciiva.com/2452/pyu-r-int-thick-7-2452965.pdf?src-supplier=Digi-Key; ComponentLink2URL: https://datasheet.ciiva.com/2452/pyu-r-int-thick-7-2452966.pdf?src-supplier=Digi-Key; ComponentLink2Description: https://datasheet.ciiva.com/2452/pyu-r-int-thick-7-2452966.pdf?src-supplier=Digi-Key; ComponentLink3URL: https://datasheet.ciiva.com/2452/pyu-r-int-thick-7-2452967.pdf?src-supplier=Digi-Key; ComponentLink3Description: https://datasheet.ciiva.com/2452/pyu-r-int-thick-7-2452967.pdf?src-supplier=Digi-Key; ComponentLink4URL: https://datasheet.ciiva.com/6169/443971-6169064.pdf?src-supplier=Farnell; ComponentLink4Description: https://datasheet.ciiva.com/6169/443971-6169064.pdf?src-supplier=Farnell; ComponentLink5URL: https://datasheet.ciiva.com/6169/443971-6169066.pdf?src-supplier=Farnell; ComponentLink5Description: https://datasheet.ciiva.com/6169/443971-6169066.pdf?src-supplier=Farnell; Supplier 2: Future Electronics; Supplier 3: Mouser; Supplier Part Number 1: 311-18KGRCT-ND; Supplier Part Number 2: RC0603JR-0718KL-CUTT; Supplier Part Number 3: 603-RC0603JR-0718KL
R5 = RC0805FR-076R8L: RES SMD 6.8 OHM 1% 1/8W 0805; Manufacturer 1: Yageo; Voltage Rating: 150V; Power Rating: 125mW; Temperature Coefficient: 200ppm/°C; Supplier 1: Digi-Key; Manufacturer Part Number 1: RC0805FR-076R8L; Stock 1: 334321; Pricing 1: 1=0.10000, 10=0.07200, 100=0.02770, 1000=0.01219, 2500=0.01053 (USD); RoHS: Yes; Case/Package: 0805; Number of Pins: 2; Case Code (Metric): 2012; Case Code (Imperial): 0805; Min Operating Temperature: -55°C; Max Operating Temperature: 155°C; Packaging: Tape and Reel; Voltage Rating (DC): 150V; Resistance: 6.8R; Tolerance: 1%; Package Quantity: 1; Composition: Thick Film; Number of Terminations: 2; Termination: SMD/SMT; Max Power Dissipation: 125mW; Features: Moisture Resistant; Length: 0.079inch; Height: 0.024inch; Width: 0.049inch; Depth: 1.25mm; REACH SVHC: No SVHC; Lead Free: Lead Free; ComponentLink1URL: https://datasheet.ciiva.com/11819/0900766b8106beab-11819870.pdf?src-supplier=RSComponents; ComponentLink1Description: https://datasheet.ciiva.com/11819/0900766b8106beab-11819870.pdf?src-supplier=RSComponents; ComponentLink2URL: https://datasheet.ciiva.com/2520/pyu-r-int-thick-7-2520880.pdf?src-supplier=Digi-Key; ComponentLink2Description: https://datasheet.ciiva.com/2520/pyu-r-int-thick-7-2520880.pdf?src-supplier=Digi-Key; ComponentLink3URL: https://datasheet.ciiva.com/12667/rc0805-12667932.pdf?src-supplier=Mouser; ComponentLink3Description: https://datasheet.ciiva.com/12667/rc0805-12667932.pdf?src-supplier=Mouser; ComponentLink4URL: https://datasheet.ciiva.com/7941/444164-7941837.pdf?src-supplier=Element14; ComponentLink4Description: https://datasheet.ciiva.com/7941/444164-7941837.pdf?src-supplier=Element14; ComponentLink5URL: https://datasheet.ciiva.com/2520/pyu-r-int-thick-7-2520878.pdf?src-supplier=Digi-Key; ComponentLink5Description: https://datasheet.ciiva.com/2520/pyu-r-int-thick-7-2520878.pdf?src-supplier=Digi-Key; ComponentLink6URL: https://datasheet.ciiva.com/7941/444164-7941838.pdf?src-supplier=Element14; ComponentLink6Description: https://datasheet.ciiva.com/7941/444164-7941838.pdf?src-supplier=Element14; ComponentLink7URL: https://datasheet.ciiva.com/2520/pyu-r-int-thick-7-2520879.pdf?src-supplier=Digi-Key; ComponentLink7Description: https://datasheet.ciiva.com/2520/pyu-r-int-thick-7-2520879.pdf?src-supplier=Digi-Key; Supplier 2: Future Electronics; Supplier 3: Mouser; Supplier Part Number 2: RC0805FR-076R8L-CUTT; Supplier Part Number 3: 603-RC0805FR-076R8L; Supplier Part Number 1: 311-6.80CRCT-ND
R8 = CRCW080588K7FKEA: RES SMD 88.7K OHM 1% 1/8W 0805; Manufacturer 1: Vishay; Resistance: 88.7kR; Temperature Coefficient: 100ppm/°C; Max Power Dissipation: 125mW; Voltage Rating (DC): 150V; Supplier 1: Digi-Key; Manufacturer Part Number 1: CRCW080588K7FKEA; Stock 1: 5728; Pricing 1: 1=0.10000, 10=0.06200, 100=0.02540, 1000=0.01142, 2500=0.00991 (USD); RoHS: Yes; Case/Package: 0805; Number of Pins: 2; Weight: 0.000194oz; Contact Plating: Tin; Case Code (Metric): 2012; Case Code (Imperial): 0805; Min Operating Temperature: -55°C; Max Operating Temperature: 155°C; Tolerance: 1%; Packaging: Tape and Reel; Composition: Thick Film; Package Quantity: 10; Number of Terminations: 2; Features: Automotive AEC-Q200; Termination: SMD/SMT; Power Rating: 125mW; Voltage Rating: 150V; Length: 0.079inch; Height: 0.02inch; Width: 0.049inch; Height - Seated (Max): 0.02inch; Radiation Hardening: No; Lead Free: Lead Free; REACH SVHC: Unknown; ComponentLink1URL: https://datasheet.ciiva.com/7816/1697337-7816134.pdf?src-supplier=Element14; ComponentLink1Description: https://datasheet.ciiva.com/7816/1697337-7816134.pdf?src-supplier=Element14; ComponentLink2URL: https://datasheet.ciiva.com/2496/dcrcwe3-2496001.pdf?src-supplier=Digi-Key; ComponentLink2Description: https://datasheet.ciiva.com/2496/dcrcwe3-2496001.pdf?src-supplier=Digi-Key; ComponentLink3URL: https://datasheet.ciiva.com/2496/dcrcwe3-2496002.pdf?src-supplier=Digi-Key; ComponentLink3Description: https://datasheet.ciiva.com/2496/dcrcwe3-2496002.pdf?src-supplier=Digi-Key; ComponentLink4URL: https://datasheet.ciiva.com/2496/dcrcwe3-2496003.pdf?src-supplier=Digi-Key; ComponentLink4Description: https://datasheet.ciiva.com/2496/dcrcwe3-2496003.pdf?src-supplier=Digi-Key; ComponentLink5URL: https://datasheet.ciiva.com/7816/1697337-7816135.pdf?src-supplier=Element14; ComponentLink5Description: https://datasheet.ciiva.com/7816/1697337-7816135.pdf?src-supplier=Element14; ComponentLink6URL: https://datasheet.ciiva.com/22705/1697337-22705887.pdf?src-supplier=Element14; ComponentLink6Description: https://datasheet.ciiva.com/22705/1697337-22705887.pdf?src-supplier=Element14; Supplier 2: Newark; Supplier 3: Mouser; Supplier Part Number 2: 53K0521; Supplier Part Number 1: 541-88.7KCCT-ND; Supplier Part Number 3: 71-CRCW0805-88.7K-E3
R10 = RC0805FR-0748R7L: RES SMD 48.7 OHM 1% 1/8W 0805; Manufacturer 1: Yageo; Temperature Coefficient: 100ppm/°C; Power Rating: 125mW; Voltage Rating: 150V; Supplier 1: Digi-Key; Manufacturer Part Number 1: RC0805FR-0748R7L; Stock 1: 11096; Pricing 1: 1=0.10000, 10=0.04000, 100=0.01630, 1000=0.00731, 2500=0.00635 (USD); RoHS: Yes; Case/Package: 0805; Contact Plating: Tin,Matte; Case Code (Metric): 2012; Case Code (Imperial): 0805; Min Operating Temperature: -55°C; Max Operating Temperature: 155°C; Resistance: 48.7R; Tolerance: 1%; Composition: Thick Film; Package Quantity: 1; Packaging: Tape and Reel; Number of Terminations: 2; Termination: SMD/SMT; Military Standard: Not; Max Power Dissipation: 125mW; Voltage Rating (DC): 150V; Features: Moisture Resistant; Length: 2mm; Height: 0.024inch; Width: 0.049inch; Depth: 1.25mm; Radiation Hardening: No; Lead Free: Lead Free; ComponentLink1URL: https://datasheet.ciiva.com/2457/pyu-r-int-thick-7-2457344.pdf?src-supplier=Digi-Key; ComponentLink1Description: https://datasheet.ciiva.com/2457/pyu-r-int-thick-7-2457344.pdf?src-supplier=Digi-Key; ComponentLink2URL: https://datasheet.ciiva.com/2457/pyu-r-int-thick-7-2457345.pdf?src-supplier=Digi-Key; ComponentLink2Description: https://datasheet.ciiva.com/2457/pyu-r-int-thick-7-2457345.pdf?src-supplier=Digi-Key; ComponentLink3URL: https://datasheet.ciiva.com/2457/pyu-r-int-thick-7-2457346.pdf?src-supplier=Digi-Key; ComponentLink3Description: https://datasheet.ciiva.com/2457/pyu-r-int-thick-7-2457346.pdf?src-supplier=Digi-Key; Supplier 2: Mouser; Supplier 3: Arrow; Supplier Part Number 1: 311-48.7CRCT-ND; Supplier Part Number 2: 603-RC0805FR-0748R7L; Supplier Part Number 3: RC0805FR-0748R7L